# EAGLE design ConfigurableDelayTimer (EAGLE 9.6.2)
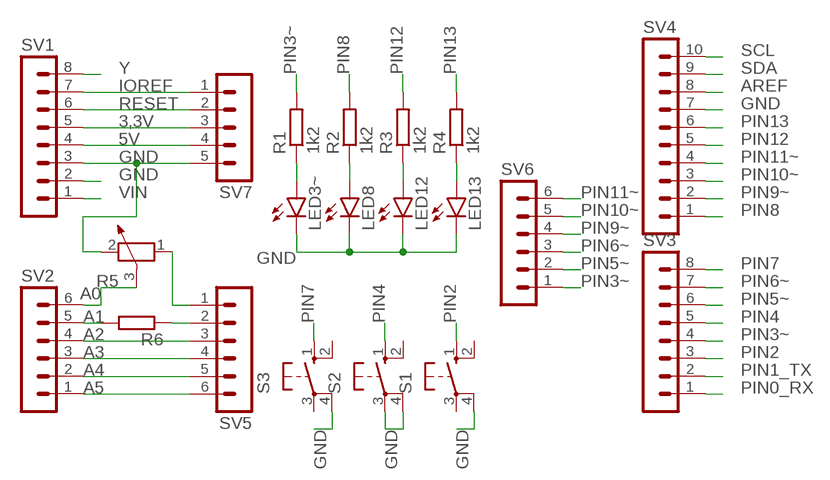
[diagram p0: schematic, sheet 1]

## Parts
LED3~  LED5MM  [LED5MM]
LED8  LED5MM  [LED5MM]
LED12  LED5MM  [LED5MM]
LED13  LED5MM  [LED5MM]
R1  1k2  R-EU_0207/7  [0207/7]
R2  1k2  R-EU_0207/7  [0207/7]
R3  1k2  R-EU_0207/7  [0207/7]
R4  1k2  R-EU_0207/7  [0207/7]
R5  POTENTIOMETER_PT-10  [PT-10]
R6  R-EU_0207/2V  [0207/2V]
S1  40-XX  [B3F-40XX]
S2  40-XX  [B3F-40XX]
S3  40-XX  [B3F-40XX]
SV1  MA08-1  [MA08-1]
SV2  MA06-1  [MA06-1]
SV3  MA08-1  [MA08-1]
SV4  MA10-1  [MA10-1]
SV5  MA06-1  [MA06-1]
SV6  MA06-1  [MA06-1]
SV7  MA05-1  [MA05-1]

## Nets
3,3V: SV1.5 SV7.3
5V: SV1.4 SV7.4
A0: R5.3 SV2.6
A1: R6.2 SV2.5
A2: SV2.4 SV5.3
A3: SV2.3 SV5.4
A4: SV2.2 SV5.5
A5: SV2.1 SV5.6
AREF: SV4.8
GND: LED3~.K(C) LED8.K(C) LED12.K(C) LED13.K(C) R5.2 S1.4(P1) S2.3(P) S2.4(P1) S3.4(P1) SV1.2 SV1.3 SV4.7 SV7.5
IOREF: SV1.7 SV7.1
N$1: LED3~.A R1.1
N$2: LED8.A R2.1
N$3: LED12.A R3.1
N$4: LED13.A R4.1
N$5: R5.1 SV5.1
N$8: R6.1 SV5.2
PIN0_RX: SV3.1
PIN1_TX: SV3.2
PIN2: S1.1(S) SV3.3
PIN3~: R1.2 SV3.4 SV6.1
PIN4: S2.1(S) SV3.5
PIN5~: SV3.6 SV6.2
PIN6~: SV3.7 SV6.3
PIN7: S3.1(S) SV3.8
PIN8: R2.2 SV4.1
PIN9~: SV4.2 SV6.4
PIN10~: SV4.3 SV6.5
PIN11~: SV4.4 SV6.6
PIN12: R3.2 SV4.5
PIN13: R4.2 SV4.6
RESET: SV1.6 SV7.2
SCL: SV4.10
SDA: SV4.9
VIN: SV1.1
Y: SV1.8
Unconnected: S1.2(S1) S1.3(P) S2.2(S1) S3.2(S1) S3.3(P)

## Library data of the parts
LED3~ LED8 LED12 LED13 = led:LED: LED OSRAM: - CHIPLED LG R971, LG N971, LY N971, LG Q971, LY Q971, LO R971, LY R971 LH N974, LH R974 LS Q976, LO Q976, LY Q976 LO Q996 - Hyper CHIPLED LW Q18S LB Q993, LB Q99A, LB R99A - SideLED LS A670, LO A670, LY A670, LG A670, LP A670 LB A673, LV A673, LT A673, LW A673 LH A674 LY A675 LS A676, LA A676, LO A676, LY A676, LW A676 LS A679, LY A679, LG A679 - Hyper Micro SIDELED® LS Y876, LA Y876, LO Y876, LY Y876 LT Y87S - SmartLED LW L88C, LW L88S LB L89C, LB L89S, LG L890 LS L89K, LO L89K, LY L89K LS L896, LA L896, LO L896, LY L896 - TOPLED LS T670, LO T670, LY T670, LG T670, LP T670 LSG T670, LSP T670, LSY T670, LOP T670, LYG T670 LG T671, LOG T671, LSG T671 LB T673, LV T673, LT T673, LW T673 LH T674 LS T676, LA T676, LO T676, LY T676, LB T676, LH T676, LSB T676, LW T676 LB T67C, LV T67C, LT T67C, LS T67K, LO T67K, LY T67K, LW E67C LS E67B, LA E67B, LO E67B, LY E67B, LB E67C, LV E67C, LT E67C LW T67C LS T679, LY T679, LG T679 LS T770, LO T770, LY T770, LG T770, LP T770 LB T773, LV T773, LT T773, LW T773 LH T774 LS E675, LA E675, LY E675, LS T675 LS T776, LA T776, LO T776, LY T776, LB T776 LHGB T686 LT T68C, LB T68C - Hyper Mini TOPLED® LB M676 - Mini TOPLED Santana® LG M470 LS M47K, LO M47K, LY M47K Source: http://www.osram.convergy.de LUXEON: - LUMILED® LXK2-PW12-R00, LXK2-PW12-S00, LXK2-PW14-U00, LXK2-PW14-V00 LXK2-PM12-R00, LXK2-PM12-S00, LXK2-PM14-U00 LXK2-PE12-Q00, LXK2-PE12-R00, LXK2-PE12-S00, LXK2-PE14-T00, LXK2-PE14-U00 LXK2-PB12-K00, LXK2-PB12-L00, LXK2-PB12-M00, LXK2-PB14-N00, LXK2-PB14-P00, LXK2-PB14-Q00 LXK2-PR12-L00, LXK2-PR12-M00, LXK2-PR14-Q00, LXK2-PR14-R00 LXK2-PD12-Q00, LXK2-PD12-R00, LXK2-PD12-S00 LXK2-PH12-R00, LXK2-PH12-S00 LXK2-PL12-P00, LXK2-PL12-Q00, LXK2-PL12-R00 Source: www.luxeon.com KINGBRIGHT: KA-3528ASYC Source: www.kingbright.com
R1-R4 R6 = rcl:R-EU_: RESISTOR, European symbol; SPICEPREFIX: R
R5 = rcl:POTENTIOMETER_: Potentiometer; SPICEMODEL: POT; SPICEPREFIX: X
S1-S3 = switch-omron:40-XX: OMRON SWITCH; MF: OMRON COMPONENTS USA; MPN: B3F-4000; OC_FARNELL: 176434; OC_NEWARK: 36K3105
SV1 SV3 = con-lstb:MA08-1: PIN HEADER; OC_FARNELL: unknown; OC_NEWARK: unknown
SV2 SV5 SV6 = con-lstb:MA06-1: PIN HEADER; OC_FARNELL: unknown; OC_NEWARK: unknown
SV4 = con-lstb:MA10-1: PIN HEADER; OC_FARNELL: unknown; OC_NEWARK: unknown
SV7 = con-lstb:MA05-1: PIN HEADER; OC_FARNELL: unknown; OC_NEWARK: unknown

## Board
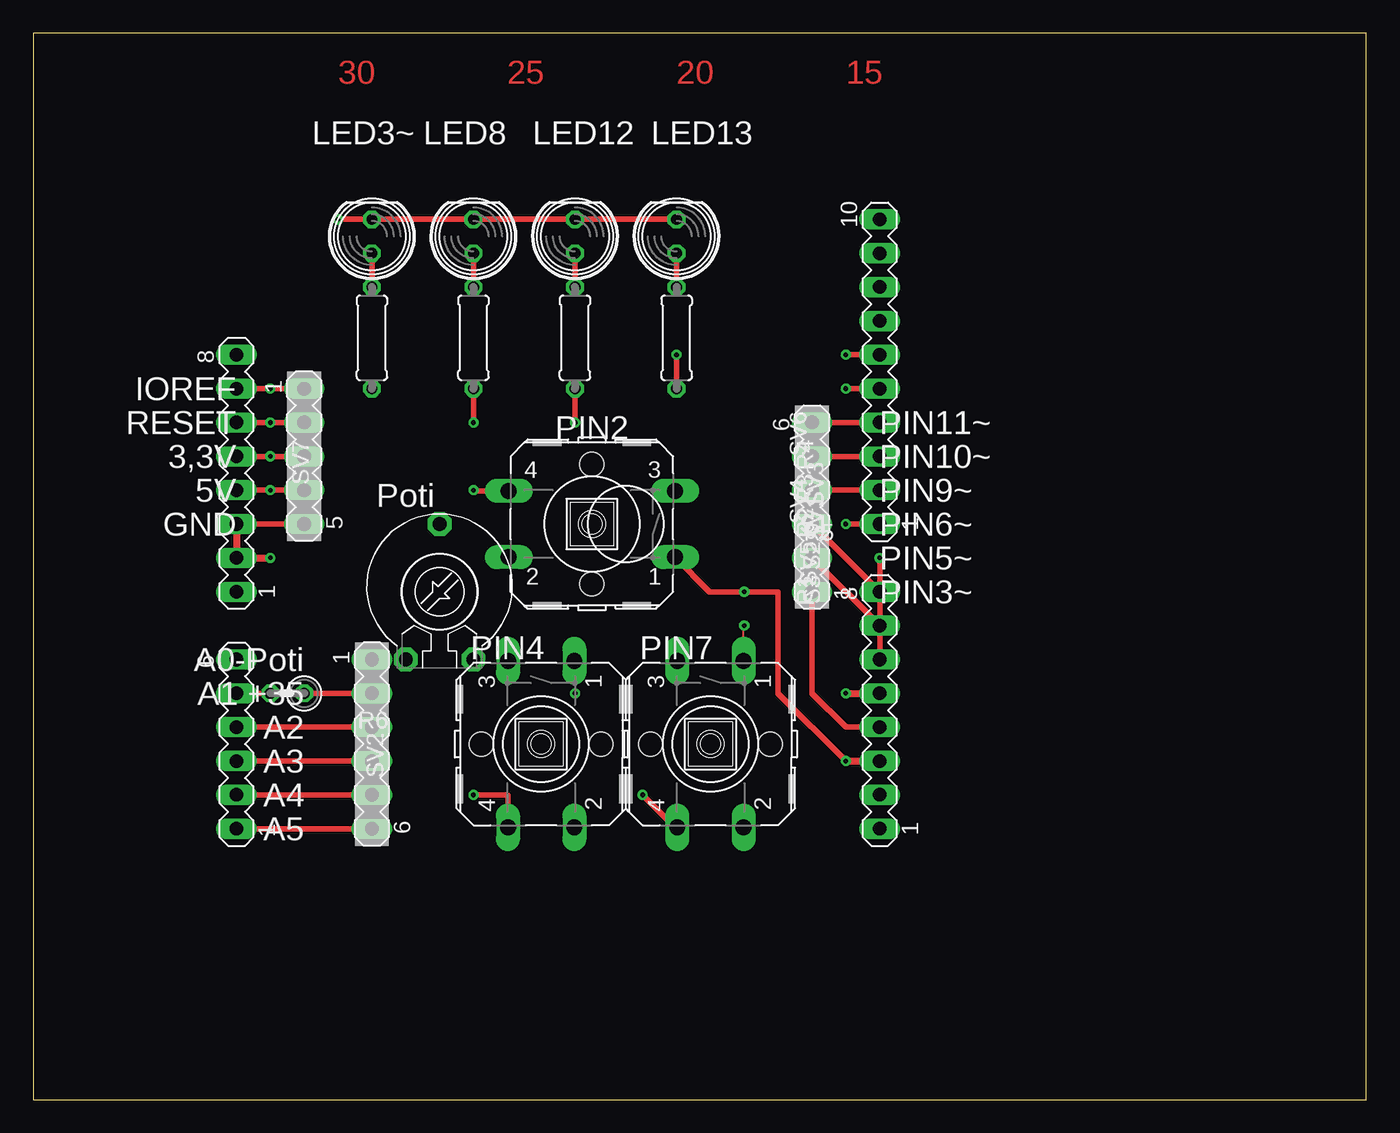
[diagram p1: board, top side]
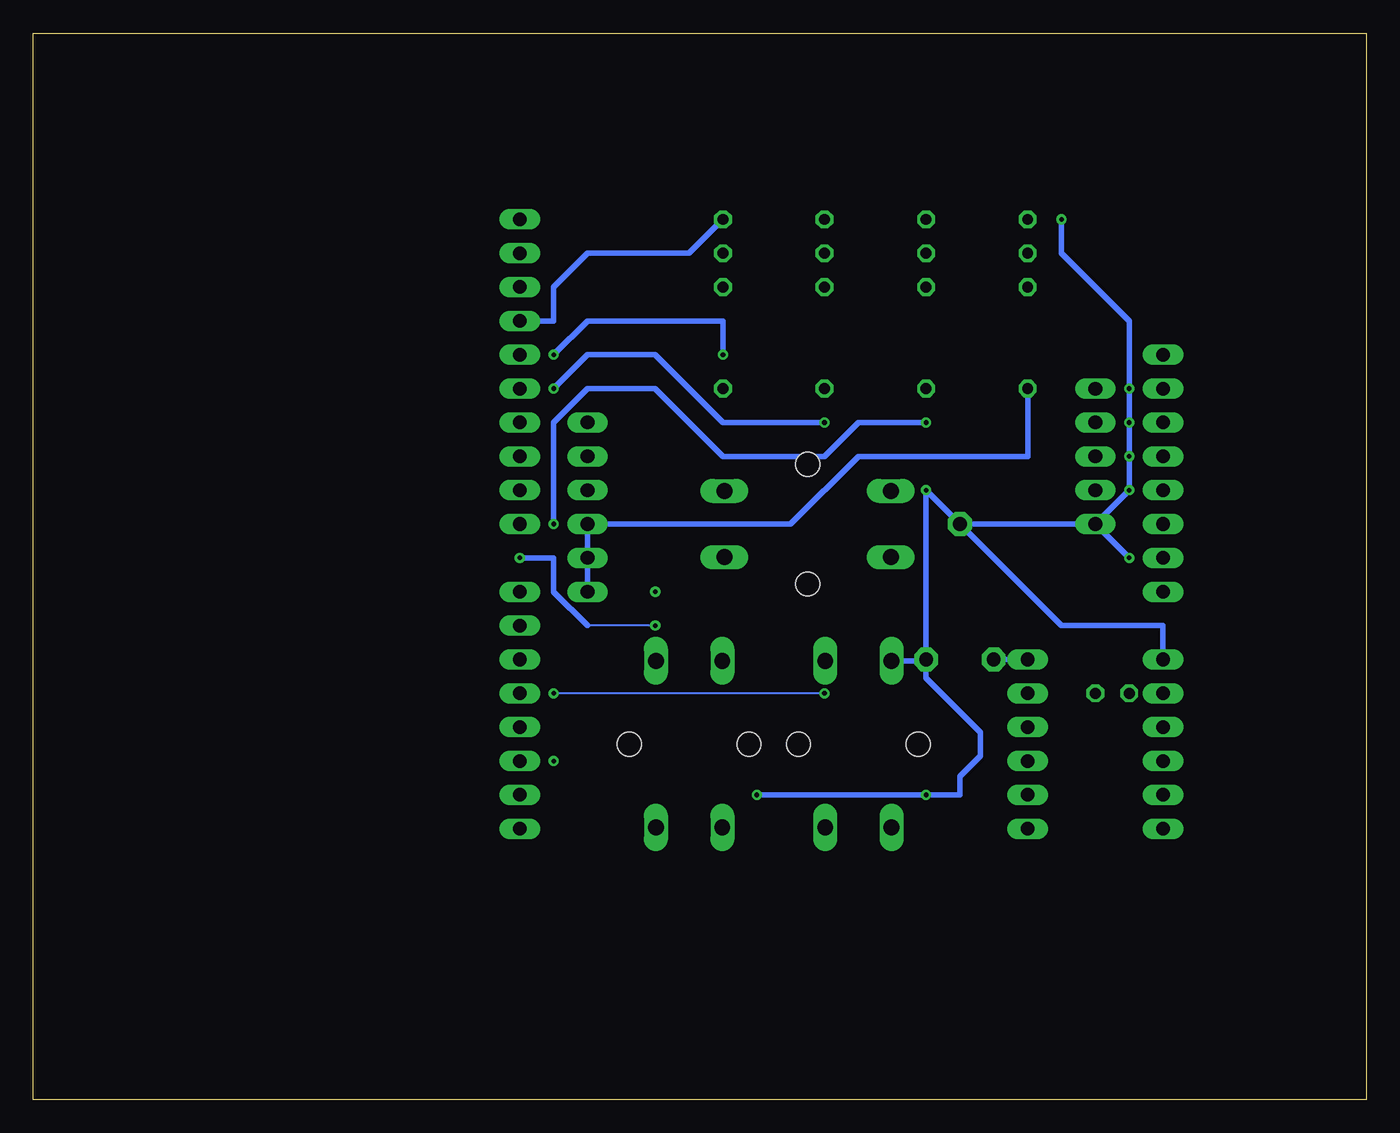
[diagram p2: board, bottom side, seen from below]

Size 100 x 80 mm. Coordinates in mm from the lower left corner, seen from the top.
Outline: 0,0 100,0 100,80 0,80 0,0
Copper layers (1*16): Top 0.035mm / dielectric 1.5mm / Bottom 0.035mm
Design rules "default": minimum track width 6mil, minimum drill 0.35mm, track to track 6mil, track to pad 6mil, pad to pad 6mil, via to via 6mil, smd to smd 6mil, copper to edge 40mil, drill to drill 6mil, minimum pad ring 10mil, minimum via ring 8mil, stop-mask expansion 4mil, vias tented up to drill 0mil, thermal gap 10mil

### Footprints (pad centres in the part's own frame; a part is rotated, then mirrored left to right if it is on the bottom)
LED5MM = drill 0.813 octagon: A -1.27,0; K 1.27,0
0207/7 = drill 0.813 octagon: 1 -3.81,0; 2 3.81,0
PT-10 = drill 1.016 pad 1.778 octagon: 1 -2.54,-5.08; 2 2.54,-5.08; 3 0,5.08
0207/2V = drill 0.813 octagon: 1 -1.27,0; 2 1.27,0
B3F-40XX = drill 1.194 long: 1 -6.248,2.489; 2 6.248,2.489; 3 -6.248,-2.489; 4 6.248,-2.489 | hole 1.803: 0,-4.496; 0,4.496
MA08-1 = drill 1.016 long: 1 -8.89,0; 2 -6.35,0; 3 -3.81,0; 4 -1.27,0; 5 1.27,0; 6 3.81,0; 7 6.35,0; 8 8.89,0
MA06-1 = drill 1.016 long: 1 -6.35,0; 2 -3.81,0; 3 -1.27,0; 4 1.27,0; 5 3.81,0; 6 6.35,0
MA10-1 = drill 1.016 long: 1 -11.43,0; 2 -8.89,0; 3 -6.35,0; 4 -3.81,0; 5 -1.27,0; 6 1.27,0; 7 3.81,0; 8 6.35,0; 9 8.89,0; 10 11.43,0
MA05-1 = drill 1.016 long: 1 -5.08,0; 2 -2.54,0; 3 0,0; 4 2.54,0; 5 5.08,0

### Placement (x,y rotation side)
LED3~  25.4,64.77 90 top
LED8  33.02,64.77 90 top
LED12  40.64,64.77 90 top
LED13  48.26,64.77 90 top
R1  25.4,57.15 270 top
R2  33.02,57.15 270 top
R3  40.64,57.15 270 top
R4  48.26,57.15 270 top
R5  30.48,38.1 0 top
R6  19.05,30.48 180 top
S1  41.91,43.18 180 top
S2  38.1,26.67 270 top
S3  50.8,26.67 270 top
SV1  15.24,46.99 90 top
SV2  15.24,26.67 90 top
SV3  63.5,29.21 90 top
SV4  63.5,54.61 90 top
SV5  25.4,26.67 270 top
SV6  58.42,44.45 90 top
SV7  20.32,48.26 270 top

### Tracks (layer width: path | path; a pad name or v marks a point on that pad's centre or on a via)
3,3V  (via drill 0.35)
  Top 0.406: SV1.5 SV7.3
  other vias: 17.78,48.26
5V  (via drill 0.35)
  Top 0.406: SV1.4 SV7.4
  other vias: 17.78,45.72
A0
  Bottom 0.406: R5.3 22.86,35.56 15.24,35.56 SV2.6
A1
  Top 0.406: SV2.5 R6.2
A2
  Top 0.406: SV2.4 SV5.3
A3
  Top 0.406: SV2.3 SV5.4
A4
  Top 0.406: SV2.2 SV5.5
A5
  Top 0.406: SV2.1 SV5.6
GND  (via drill 0.35)
  Top 0.406: v22.86,66.04 LED3~.K LED8.K LED12.K LED13.K | S1.4 33.07,45.67 v33.02,45.72 | S2.4 35.61,22.81 35.56,22.86 v33.02,22.86 | S3.4 48.16,20.42 v45.72,22.86 | SV7.5 SV1.3
  Top 0.508: v17.78,40.64 SV1.2 SV1.3
  Bottom 0.406: v22.86,66.04 22.86,63.5 17.78,58.42 17.78,45.72 SV7.5 | SV7.5 30.48,43.18 v33.02,45.72 R5.2 | v45.72,22.86 v33.02,22.86 30.48,22.86 30.48,24.25 28.94,25.79 28.94,27.55 33.02,31.62 R5.2 | SV7.5 v17.78,40.64 | R5.2 33.12,32.92 S2.3 | LED13.K 50.8,63.5 58.42,63.5 60.96,60.96 60.96,58.42 SV4.7
  Bottom 0.508: S2.4 35.56,20.47 | S3.4 48.41,20.32
IOREF  (via drill 0.35)
  Top 0.406: SV1.7 SV7.1
  other vias: 17.78,53.34
N$1
  Top 0.406: LED3~.A R1.1
N$2
  Top 0.406: LED8.A R2.1
N$3
  Top 0.406: LED12.A R3.1
N$4
  Top 0.406: LED13.A R4.1
N$5
  Bottom 0.406: R5.1 SV5.1
N$8
  Top 0.406: R6.1 SV5.2
PIN2  (via drill 0.35)
  Top 0.406: S1.1 50.75,38.1 55.88,38.1 55.88,30.48 v60.96,25.4
  Top 0.508: v60.96,25.4 SV3.3
PIN3~  (via drill 0.35)
  Top 0.406: SV6.1 58.42,30.48 60.96,27.94 SV3.4
  Bottom 0.406: SV6.1 58.42,43.18 43.18,43.18 38.1,48.26 25.4,48.26 R1.2
  other vias: 53.34,38.1
PIN4  (via drill 0.35)
  Top 0.152: S2.1 40.64,32.87 v40.64,30.48
  Top 0.508: v60.96,30.48 SV3.5
  Bottom 0.152: v40.64,30.48 v60.96,30.48
PIN5~
  Top 0.406: SV3.6 63.5,35.56 SV6.2
PIN6~
  Top 0.406: SV3.7 63.5,38.1 SV6.3
PIN7  (via drill 0.35)
  Top 0.152: S3.1 53.29,35.51 v53.34,35.56
  Top 0.406: S3.1 53.34,32.97 | SV3.8 v63.5,40.64
  Bottom 0.152: v53.34,35.56 58.42,35.56
  Bottom 0.406: v63.5,40.64 60.96,40.64 60.96,38.1 58.42,35.56
PIN8  (via drill 0.35)
  Top 0.406: R2.2 v33.02,50.8 | v60.96,43.18 SV4.1
  Bottom 0.406: v33.02,50.8 38.1,50.8 40.64,48.26 48.26,48.26 53.34,53.34 58.42,53.34 60.96,50.8 v60.96,43.18
PIN9~
  Top 0.406: SV4.2 SV6.4
PIN10~
  Top 0.406: SV4.3 SV6.5
PIN11~
  Top 0.406: SV4.4 SV6.6
PIN12  (via drill 0.35)
  Top 0.406: R3.2 v40.64,50.8 | v60.96,53.34 SV4.5
  Bottom 0.406: v40.64,50.8 48.26,50.8 53.34,55.88 58.42,55.88 v60.96,53.34
PIN13  (via drill 0.35)
  Top 0.406: R4.2 v48.26,55.88 | v60.96,55.88 SV4.6
  Bottom 0.406: v60.96,55.88 58.42,58.42 48.26,58.42 v48.26,55.88
RESET  (via drill 0.35)
  Top 0.406: SV1.6 SV7.2
  other vias: 17.78,50.8

### Text on the board
Top: 30 | 25 | 20 | 15
tNames: IOREF | RESET | PIN11~ | PIN2 | 3,3V | PIN10~ | 5V | PIN9~ | Poti | GND | PIN6~ | PIN5~ | PIN3~ | A0-Poti | PIN4 | PIN7 | A1 +35 | A2 | A3 | A4 | A5